# Altium schematic sheet OLED.SchDoc
size A4; SheetNumber: 2; SheetTotal: 2
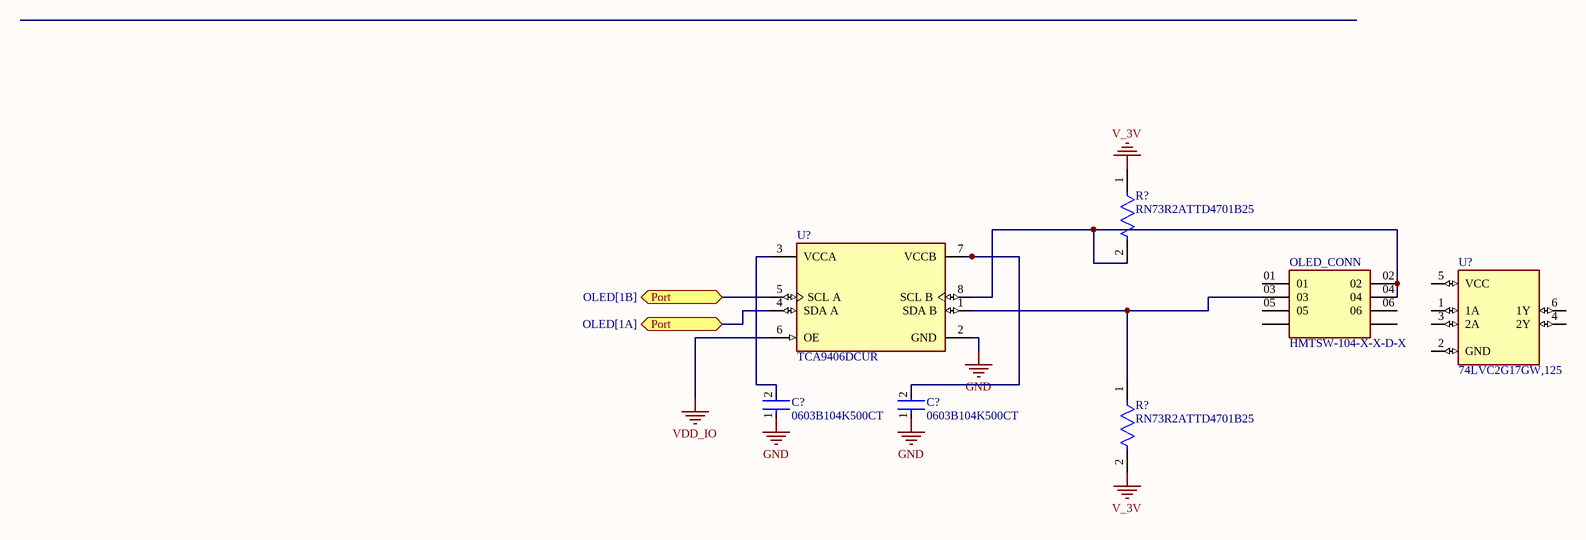
[diagram p0: OLED.SchDoc]

## Parts
(Parts that share a designator on the sheet are numbered #1, #2 ... from top to bottom, then left to right.)
C?#1  0603B104K500CT  [FP-0603B104K500CT-IPC_C]
C?#2  0603B104K500CT  [FP-0603B104K500CT-IPC_C]
OLED_CONN  HMTSW-104-X-X-D-X  [SAMTEC_HMTSW-104-X-X-D-X]
R?#1  RN73R2ATTD4701B25  [FP-RN73R2A-IPC_C]
R?#2  RN73R2ATTD4701B25  [FP-RN73R2A-IPC_C]
U?#1  TCA9406DCUR  [FP-DCU0008A-IPC_B]
U?#2  74LVC2G17GW,125  [SOT363_INFINEON]

## Ports
Port (bidir, see OLED[1A]), Port (bidir, see OLED[1B])

## Nets
GND: C?#1.1 C?#2.1 U?#1.2(GND)
V_3V: R?#1.1 R?#2.2
VDD_IO: U?#1.6(OE)
Port: U?#1.4(SDA_A) U?#1.5(SCL_A) ; port Port
NetC?#1_2: C?#1.2 U?#1.3(VCCA)
NetC?#2_2: C?#2.2 U?#1.7(VCCB)
NetOLED_CONN_02: OLED_CONN.02 OLED_CONN.04 R?#1.2 U?#1.8(SCL_B)
NetOLED_CONN_03: OLED_CONN.03 R?#2.1 U?#1.1(SDA_B)

Not connected (* = marked no-connect by the designer): OLED_CONN 01 05 06 07 08; U?#2 1(1A) 2(GND) 3(2A) 4(2Y) 5(VCC) 6(1Y)

## Library data of the parts
C?#1 C?#2 = CMP-45632-000007-1: CAP CER 0.1UF 50V X7R 0603; Tolerance: 10%; Capacitance: 100nF; Radiation Hardening: No; Depth: 0.8mm; Length: 1.6mm; Voltage Rating: 50V; Dielectric: X7R; Case/Package: 0603; RoHS Compliant: Yes; Case Code (Metric): 1608; Voltage Rating (DC): 50V; Min Operating Temperature: -55°C; Series: -; Max Operating Temperature: 125°C; Lead Free: Lead Free; Case Code (Imperial): 0603; Packaging: Tape and Reel
OLED_CONN = CMP-002-00071-1: Connector Header Through Hole 8 position 0.100 (2.54mm); MP: HMTSW-104-07-L-D-240-LL; MF: Samtec; Component Type: Standard; Value: *; Case/Package: None; Check_prices: https://www.snapeda.com/parts/HMTSW-104-07-L-D-240-LL/Samtec+Inc./view-part/?ref=eda; SnapEDA_Link: https://www.snapeda.com/parts/HMTSW-104-07-L-D-240-LL/Samtec+Inc./view-part/?ref=snap; Pins: 8; Design Item ID: HMTSW-104-X-X-D-X; Source: HMTSW-104-X-X-D-X.SchLib
R?#1 R?#2 = CMP-04015-010540-1: 4.7kΩ ±0.1% 0.125W, 1/8W Chip Resistor 0805 (2012 Metric) Moisture Resistant Thin Film
U?#1 = CMP-0314-00417-3: IC TRNSLTR BIDIRECTIONAL US8; Propagation Delay: 4.4ns; Min Supply Voltage: 1.65V; Low Level Output Current: 50mA; Logic Function: Translator; Data Rate: 24Mbps; Turn-On Delay Time: 260ns; Max Supply Voltage: 5.5V; Number of Channels: 2; High Level Output Current: -50mA; Output Type: Voltage; Number of Pins: 8; Weight: 0.00067oz; Lead Free: Lead Free; Case/Package: VSSOP; Packaging: Tape and Reel; REACH SVHC: No SVHC; Package Quantity: 1; Length: 2.1mm; Contact Plating: Gold; Width: 2.4mm; Radiation Hardening: No; Number of Bits: 2; Height: 0.8mm; Number of Outputs: 2; Max Operating Temperature: 85°C; Min Operating Temperature: -40°C
U?#2 = CMP-003-000000-1: Buffer, Non-Inverting 2 Element 1 Bit per Element Push-Pull Output 6-TSSOP; MF: Nexperia USA; Design Item ID: 74LVC2G17GW,125; Value: *; Package: TSSOP6-6 Nexperia USA Inc.; MP: 74LVC2G17GW,125; Component Type: Standard; SnapEDA_Link: https://www.snapeda.com/parts/74LVC2G17GW,125/Nexperia/view-part/?ref=snap; Pin Count: 6; Check_prices: https://www.snapeda.com/parts/74LVC2G17GW,125/Nexperia/view-part/?ref=eda; Source: 74LVC2G17GW,125.SchLib